# EAGLE design peter5_2 (EAGLE 7.6.0)

## Sheet 1 of 2
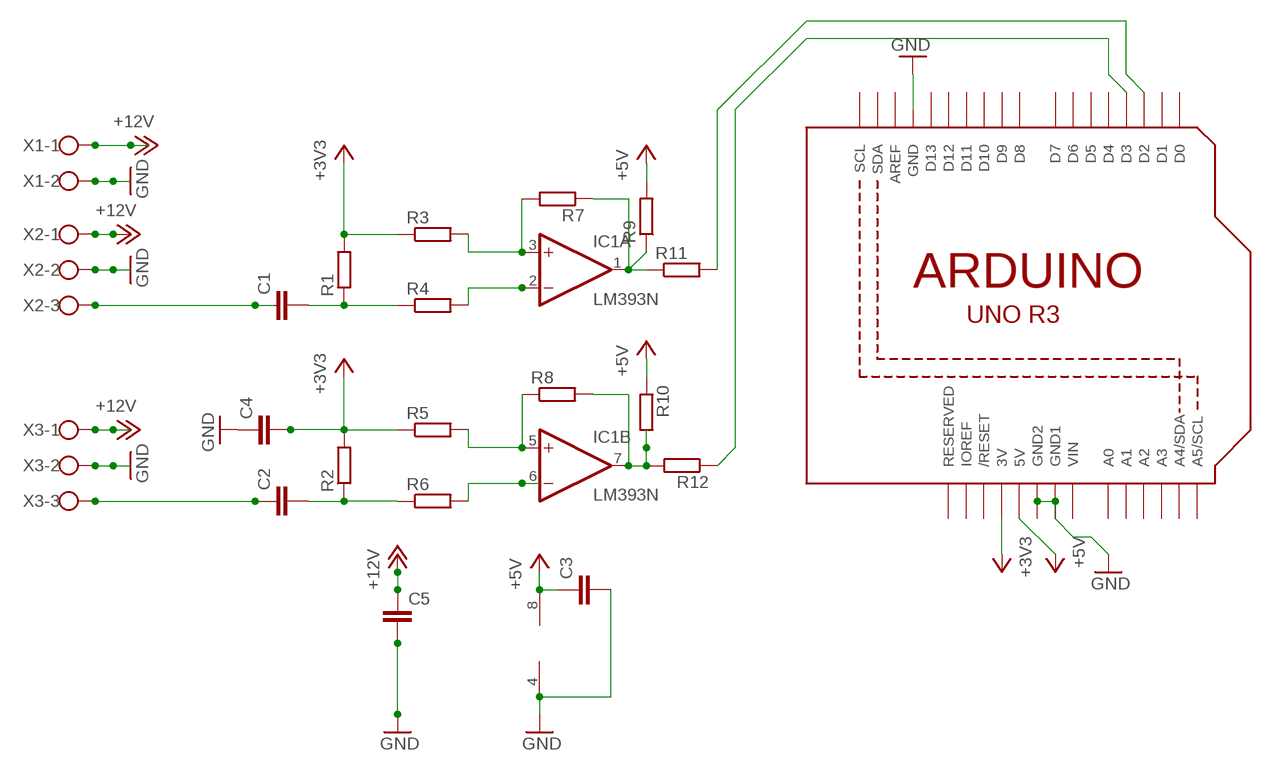
[diagram p0: schematic, sheet 1]

### Parts
C1  C-EU025-040X050  [C025-040X050]
C2  C-EU025-040X050  [C025-040X050]
C3  C-EU025-040X050  [C025-040X050]
C4  C-EU025-040X050  [C025-040X050]
C5  C2.5/2  [C2.5-2]
IC1  LM393N  [DIL08]
R1  R-EU_0207/7  [0207/7]
R2  R-EU_0207/7  [0207/7]
R3  R-EU_0207/7  [0207/7]
R4  R-EU_0207/7  [0207/7]
R5  R-EU_0207/7  [0207/7]
R6  R-EU_0207/7  [0207/7]
R7  R-EU_0207/7  [0207/7]
R8  R-EU_0207/7  [0207/7]
R9  R-EU_0207/7  [0207/7]
R10  R-EU_0207/7  [0207/7]
R11  R-EU_0207/7  [0207/7]
R12  R-EU_0207/7  [0207/7]
U1  ARDUINOR3-BPLACE  [ARDUINOR3-BPLACE]
X1  W237-102  [W237-102]
X2  W237-103  [W237-103]
X3  W237-103  [W237-103]

### Nets
+3V3: C4.2 R1.2 R2.2 R3.1 R5.1 U1.3V
+5V: C3.1 IC1.8(P:V+) R9.2 R10.1 U1.5V
+12V: C5.1 X1.1 X2.1 X3.1
GND: C3.2 C4.1 C5.2 IC1.4(P:V-) X1.2 X2.2 X3.2
N$1: IC1.3(A:+IN) R3.2 R7.2
N$2: IC1.2(A:-IN) R4.2
N$3: IC1.1(A:OUT) R7.1 R9.1 R11.1
N$4: R11.2 U1.D2
N$5: R12.1 U1.D3
N$6: C1.2 R1.1 R4.1
N$7: IC1.7(B:OUT) R8.2 R10.2 R12.2
N$8: C2.1 X3.3
N$9: IC1.5(B:+IN) R5.2 R8.1
N$10: IC1.6(B:-IN) R6.2
N$11: C2.2 R2.1 R6.1
N$12: C1.1 X2.3
Unconnected: U1.A0 U1.A1 U1.A2 U1.A3 U1.A4(A4/SDA) U1.A5(A5/SCL) U1.AREF U1.D0 U1.D1 U1.D4 U1.D5 U1.D6 U1.D7 U1.D8 U1.D9 U1.D10 U1.D11 U1.D12 U1.D13 U1.IOREF U1.RESERVED U1.RESET(/RESET) U1.SCL U1.SDA

## Sheet 2 of 2

## Power pins joined to a net without a drawn wire
GND: U1.GND
GND1: U1.GND1
GND2: U1.GND2
VIN: U1.VIN

## Library data of the parts
C1-C4 = resistor:C-EU: CAPACITOR, European symbol; OC_FARNELL: unknown
C5 = capacitor-wima:C: CAPACITOR naming: grid - package width
IC1 = linear:LM393: COMPARATOR; MF: FAIRCHILD SEMICONDUCTOR; MPN: LM393N...; OC_FARNELL: 1795977
R1-R12 = resistor:R-EU_: RESISTOR, European symbol; OC_FARNELL: unknown
U1 = adafruit:ARDUINOR3: This is a new object for the new Arduino R3 - with extra pins that you may want to use (such as IOref, and duplicated A4/A5; OC_FARNELL: unknown
X1 = con-wago-500:W237-102: WAGO SCREW CLAMP; MPN: 237-102; OC_FARNELL: unknown; OC_NEWARK: 70K9898
X2 X3 = con-wago-500:W237-103: WAGO SCREW CLAMP; MPN: 237-103; OC_FARNELL: unknown; OC_NEWARK: 18M7116

## Board
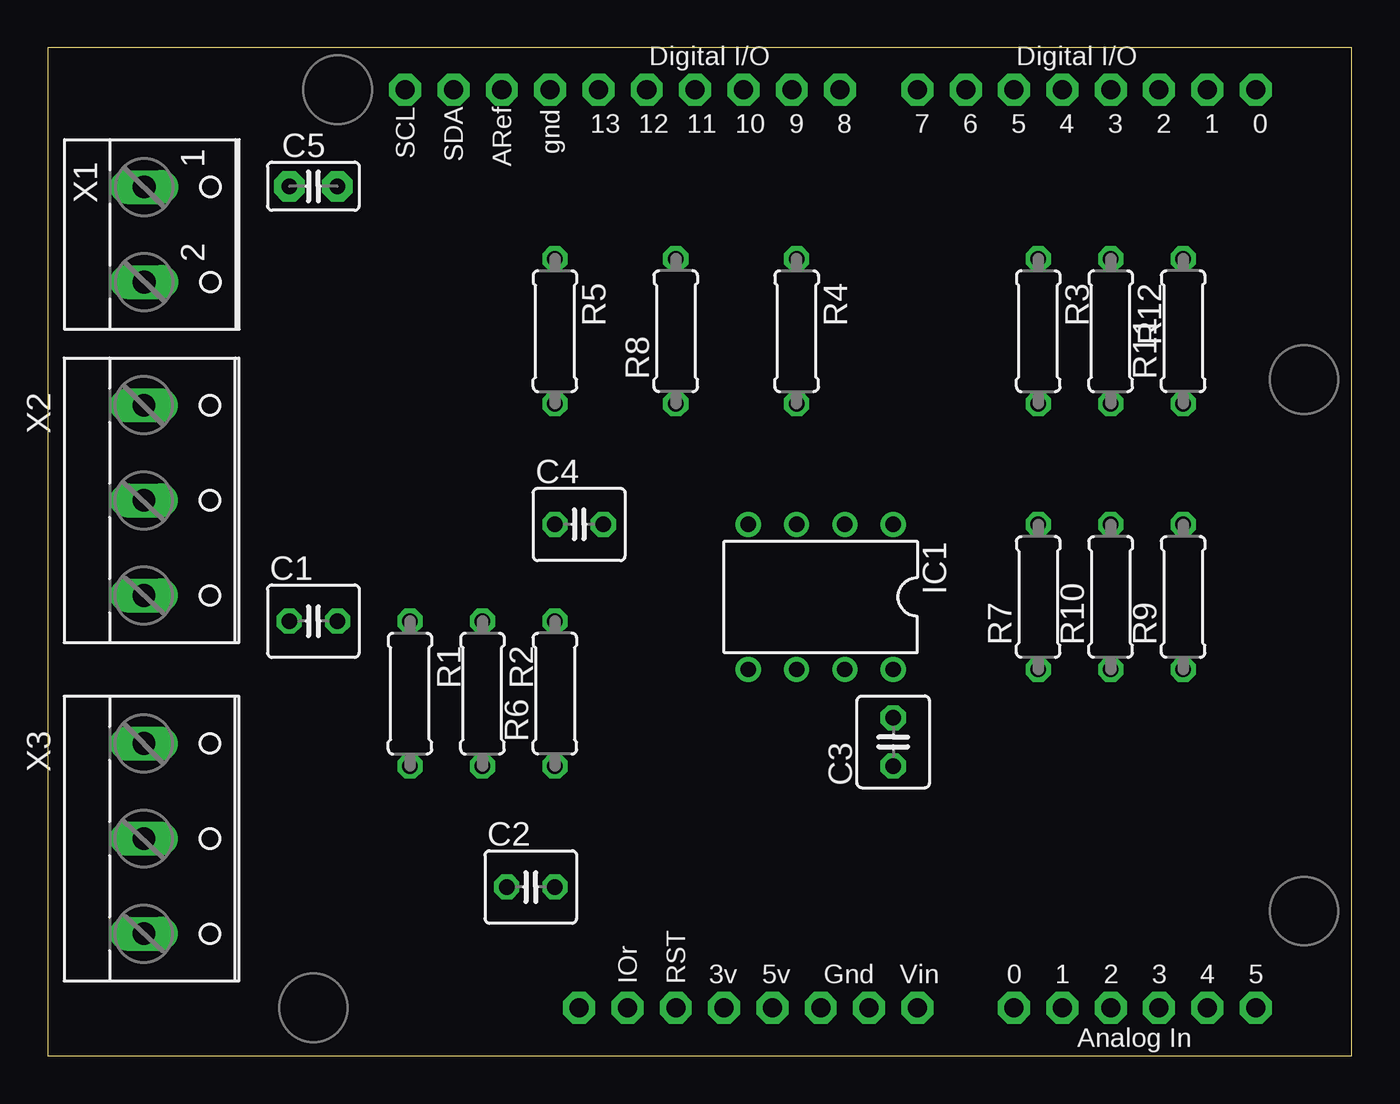
[diagram p1: board, top side]
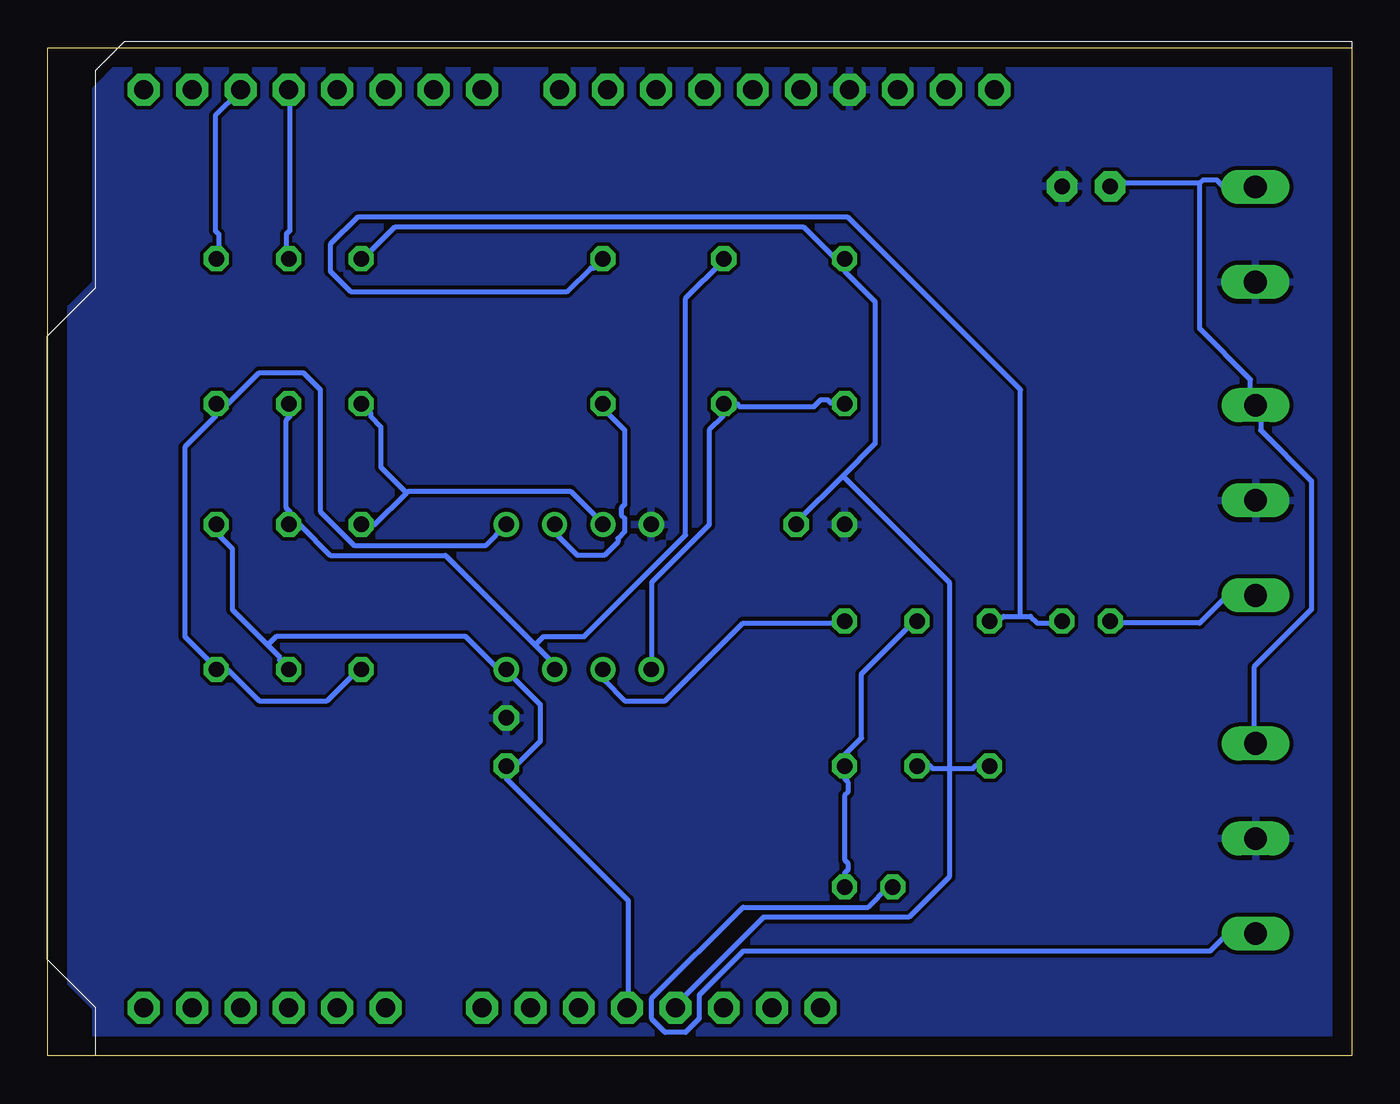
[diagram p2: board, bottom side, seen from below]

Size 68.56 x 53.01 mm. Coordinates in mm from the lower left corner, seen from the top.
Outline: 0,0 68.56,0 68.56,53.01 0,53.01 0,0
Copper layers (1*16): Top 0.035mm / dielectric 1.5mm / Bottom 0.035mm
Design rules "default": minimum track width 10mil, minimum drill 24mil, track to track 8mil, track to pad 8mil, pad to pad 8mil, via to via 8mil, smd to smd 8mil, copper to edge 40mil, drill to drill 8mil, minimum pad ring 10mil, minimum via ring 8mil, stop-mask expansion 4mil, vias tented up to drill 0mil, thermal gap 10mil

### Footprints (pad centres in the part's own frame; a part is rotated, then mirrored left to right if it is on the bottom)
C025-040X050 = drill 0.813 octagon: 1 -1.27,0; 2 1.27,0
C2.5-2 = drill 0.813 pad 1.6 octagon: 1 -1.27,0; 2 1.27,0
DIL08 = drill 0.813 pad 1.27: 1 -3.81,-3.81; 2 -1.27,-3.81; 3 1.27,-3.81; 4 3.81,-3.81; 5 3.81,3.81; 6 1.27,3.81; 7 -1.27,3.81; 8 -3.81,3.81
0207/7 = drill 0.813 octagon: 1 -3.81,0; 2 3.81,0
ARDUINOR3-BPLACE = drill 1 pad 1.676 octagon: 3V 35.56,2.54; 5V 38.1,2.54; A0 50.8,2.54; A1 53.34,2.54; A2 55.88,2.54; A3 58.42,2.54; A4 60.96,2.54; A5 63.5,2.54; AREF 23.876,50.8; D0 63.5,50.8; D1 60.96,50.8; D2 58.42,50.8; D3 55.88,50.8; D4 53.34,50.8; D5 50.8,50.8; D6 48.26,50.8; D7 45.72,50.8; D8 41.656,50.8; D9 39.116,50.8; D10 36.576,50.8; D11 34.036,50.8; D12 31.496,50.8; D13 28.956,50.8; GND 26.416,50.8; GND1 43.18,2.54; GND2 40.64,2.54; IOREF 30.48,2.54; RESERVED 27.94,2.54; RESET 33.02,2.54; SCL 18.796,50.8; SDA 21.336,50.8; VIN 45.72,2.54
W237-102 = drill 1.194 long: 1 -2.5,-1.27; 2 2.5,-1.27
W237-103 = drill 1.194 long: 1 -5,-1.29; 2 0,-1.29; 3 5,-1.29

### Placement (x,y rotation side)
C1  13.97,22.86 0 top
C2  25.4,8.89 0 top
C3  44.45,16.51 90 top
C4  27.94,27.94 0 top
C5  13.97,45.72 0 top
IC1  40.64,24.13 180 top
R1  19.05,19.05 270 top
R2  22.86,19.05 270 top
R3  52.07,38.1 270 top
R4  39.37,38.1 270 top
R5  26.67,38.1 270 top
R6  26.67,19.05 90 top
R7  52.07,24.13 90 top
R8  33.02,38.1 90 top
R9  59.69,24.13 90 top
R10  55.88,24.13 90 top
R11  59.69,38.1 90 top
R12  55.88,38.1 270 top
U1  0,0 0 top
X1  6.35,43.18 270 top
X2  6.35,29.21 270 top
X3  6.35,11.43 270 top

### Tracks (layer width: path | path; a pad name or v marks a point on that pad's centre or on a via)
+3V3
  Bottom 0.254: 21.16,15.11 22.05,15.11 22.23,15.29 22.76,15.29 R2.2 | 21.16,15.11 19.91,15.11 19.74,15.29 19.2,15.29 R1.2 | 21.16,15.11 21.16,9.42 23.29,7.29 30.94,7.29 35.56,2.67 U1.3V | 26.76,30.49 25.07,32.18 25.07,39.65 26.67,41.25 R5.1 26.67,41.96 27.2,41.96 28.8,43.56 50.32,43.56 51.92,41.96 R3.1 | 26.76,30.49 29.16,28.09 C4.2 | 21.16,15.11 21.16,24.89 26.76,30.49
+5V
  Bottom 0.254: R10.1 56.36,20.8 56.36,20.98 56.98,21.6 | 56.98,21.6 58.85,23.47 58.85,26.67 59.56,27.38 59.56,27.91 R9.2 | U1.5V 38.05,2.67 38.05,8.18 44.45,14.58 C3.1 44.45,15.29 43.92,15.29 42.67,16.54 42.67,18.49 44.45,20.27 IC1.8 44.45,20.45 44.98,20.45 46.58,22.05 56.54,22.05 56.98,21.6
+12V
  Bottom 0.254: 8,45.87 12.62,45.87 C5.1 | 8,45.87 7.82,46.05 7.11,46.05 6.76,45.7 5.16,45.7 X1.1 | X3.1 5.16,16.54 5.16,20.45 2.13,23.47 2.13,30.23 4.8,32.89 4.8,33.96 4.98,34.14 X2.1 5.16,34.31 5.33,34.49 5.33,35.56 8,38.23 8,45.87
GND
  pour Bottom: 0,0 0,53.34 64.77,53.34 64.77,52.07 66.04,50.8 66.04,40.64 68.58,38.1 68.58,5.08 66.04,2.54 66.04,0
N$1
  Bottom 0.254: 49.7,29.6 51.38,27.91 51.92,27.91 R7.2 | 49.7,29.6 49.61,29.69 41.07,29.69 39.47,28.09 IC1.3 | R3.2 51.56,33.78 51.56,33.6 51.03,33.07 51.03,30.94 49.7,29.6
N$2
  Bottom 0.254: IC1.2 41.78,27.91 41.78,27.38 40.72,26.31 39.29,26.31 38.58,27.03 38.58,27.2 38.23,27.56 38.23,28.27 38.41,28.45 38.41,28.8 38.23,28.98 38.23,32.89 39.47,34.14 R4.2
N$3
  Bottom 0.254: R7.1 52.09,20.27 52.27,20.27 53.87,18.67 57.43,18.67 59.03,20.27 59.56,20.27 R9.1 59.74,20.45 61.34,22.05 61.34,32 59.74,33.6 59.74,34.14 R11.1 59.56,34.31 59.03,34.31 57.43,35.92 55.12,35.92 54.23,35.03 54.23,28.63 52.45,26.85 45.52,26.85 44.45,27.91 IC1.1
N$4
  Bottom 0.254: R11.2 59.56,41.96 59.56,43.2 59.74,43.38 59.74,49.43 58.5,50.67 U1.D2
N$5
  Bottom 0.254: R12.1 56.01,41.96 56.01,43.2 55.83,43.38 55.83,50.67 U1.D3
N$6
  Bottom 0.254: 17.42,23.11 18.31,23.11 18.49,22.94 19.02,22.94 R1.1 | 17.42,23.11 16.89,23.11 16.54,22.76 15.29,22.76 C1.2 | 17.42,23.11 17.42,35.03 26.49,44.09 52.27,44.09 53.7,42.67 53.7,41.25 52.63,40.18 41.25,40.18 40.01,41.43 39.83,41.43 39.47,41.78 R4.1
N$7
  Bottom 0.254: 42.94,21.6 47.65,26.31 53.7,26.31 55.3,27.91 55.83,27.91 R10.2 55.83,28.09 55.83,28.63 56.01,28.8 56.01,33.43 55.83,33.6 55.83,34.14 R12.2 | 42.94,21.6 41.96,20.62 41.96,20.45 IC1.7 | 42.94,21.6 42.49,22.05 40.36,22.05 35.03,27.38 35.03,39.83 33.07,41.78 R8.2
N$8
  Bottom 0.254: C2.1 24.36,8.89 25.43,7.82 32,7.82 36.8,3.02 36.8,1.96 36.09,1.25 35.03,1.25 34.31,1.96 34.31,3.2 32,5.51 7.47,5.51 6.58,6.4 5.16,6.4 X3.3
N$9
  Bottom 0.254: IC1.5 36.8,20.45 36.8,24.89 33.78,27.91 33.78,32.89 33.07,33.6 33.07,34.14 R8.1 32.89,34.31 32.36,34.31 32.18,34.14 28.27,34.14 27.91,34.49 27.56,34.49 27.38,34.31 26.67,34.31 R5.2
N$10
  Bottom 0.254: R6.2 26.67,22.76 32,22.76 36.09,18.67 38.23,18.67 39.29,19.74 39.29,20.27 IC1.6
N$11
  Bottom 0.254: C2.2 26.67,9.6 26.49,9.78 26.49,10.13 26.67,10.31 26.67,13.69 26.49,13.87 26.49,14.4 26.67,14.58 R6.1 26.67,15.82 25.78,16.71 25.78,20.09 23.11,22.76 22.94,22.76 R2.1
N$12
  Bottom 0.254: C1.1 12.62,22.76 8,22.76 6.58,24.18 5.16,24.18 X2.3